# Altium project iron_board.PrjPcb
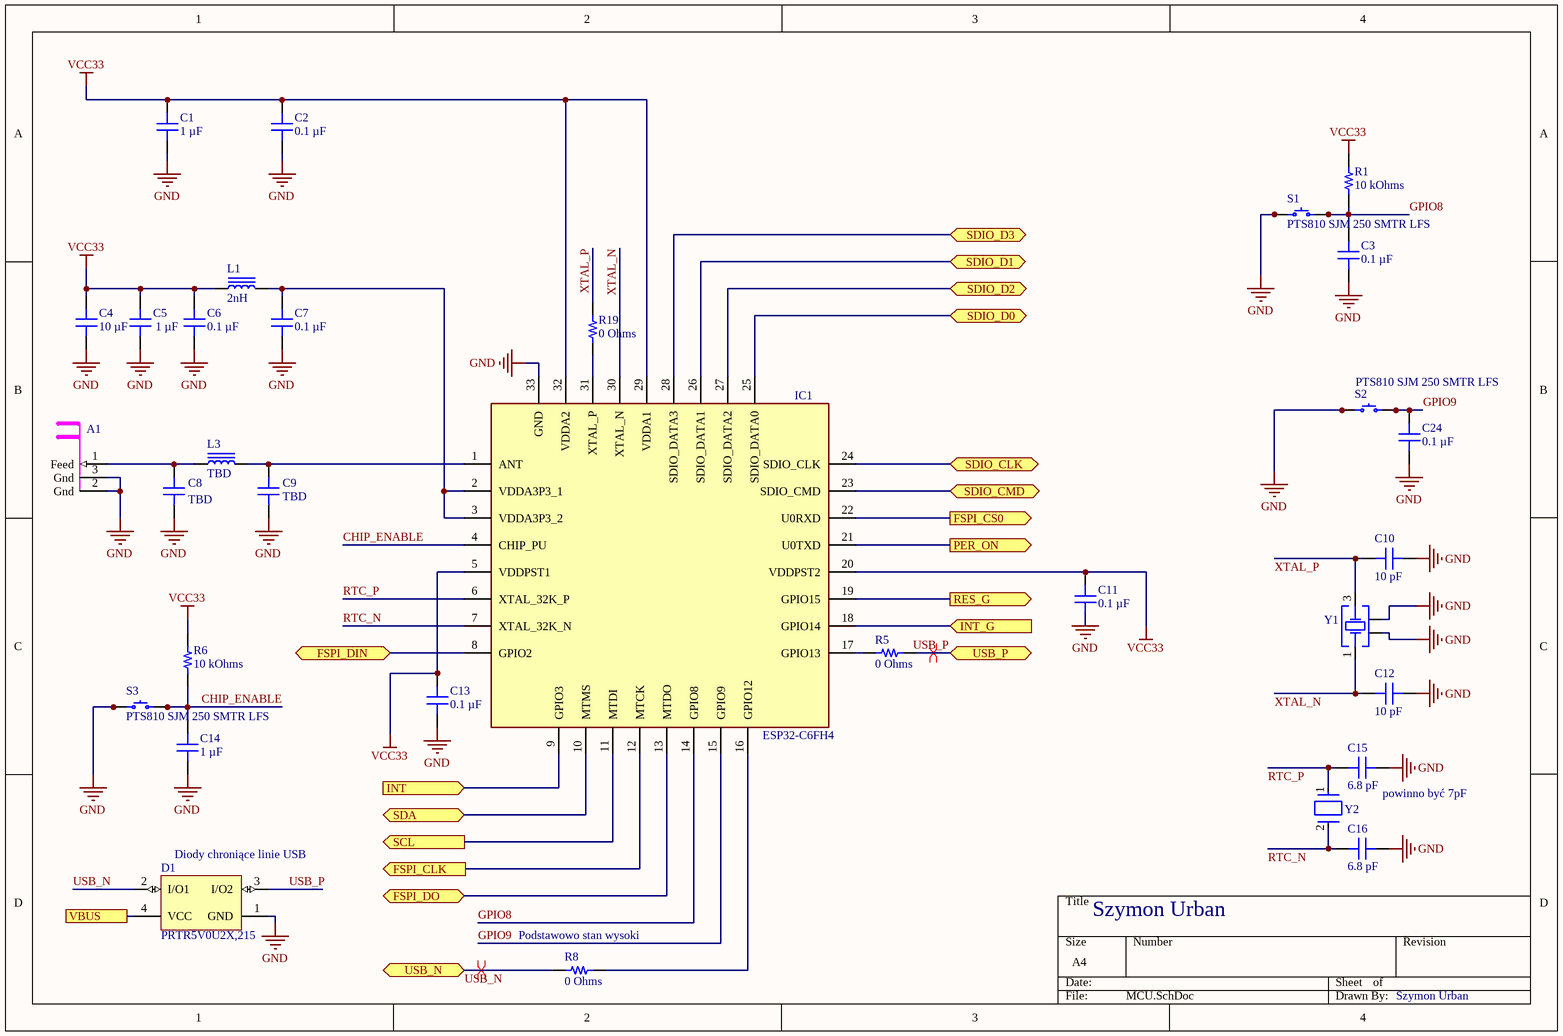
[diagram p0: MCU.SchDoc]
2 sheets, 73 parts. Net scope: flat (ports and power ports of the same name join across sheets).
Board file: iron_board_PCB.PcbDoc
Sheets:
  MCU.SchDoc
  peripherals.SchDoc

## Sheet MCU.SchDoc
size A4; SheetNumber: 1; SheetTotal: 2

### Parts
A1  Inverted F Antenna 2.4GHz  [IFA_2.4GHz]  (value not drawn)  (net tie, no BOM)
C1  1 µF  [CAP 0603_1608]
C2  0.1 µF  [CAP 0603_1608]
C3  0.1 µF  [CAP 0603_1608]
C4  10 µF  [CAP 0603_1608]
C5  1 µF  [CAP 0603_1608]
C6  0.1 µF  [CAP 0603_1608]
C7  0.1 µF  [CAP 0603_1608]
C8  TBD  [CAP 0402_1005]
C9  TBD  [CAP 0402_1005]
C10  10 pF  [CAP 0603_1608]
C11  0.1 µF  [CAP 0603_1608]
C12  10 pF  [CAP 0603_1608]
C13  0.1 µF  [CAP 0603_1608]
C14  1 µF  [CAP 0603_1608]
C15  6.8 pF  [CAP 0603_1608]
C16  6.8 pF  [CAP 0603_1608]
C24  0.1 µF  [CAP 0603_1608]
D1  PRTR5V0U2X,215  [NXP-SOT143B-4_V]
IC1  ESP32-C6FH4  [QFN50P500X500X90-33N]
L1  2nH  [IND 0603_1608 RF WW]
L3  TBD  [IND 0402_1005 RF WW]
R1  10 kOhms  [RES 0603_1608]
R5  0 Ohms  [RES 0603_1608]
R6  10 kOhms  [RES 0603_1608]
R8  0 Ohms  [RES 0603_1608]
R19  0 Ohms  [RES 0603_1608]
S1  PTS810 SJM 250 SMTR LFS  [C&K PTS810]
S2  PTS810 SJM 250 SMTR LFS  [C&K PTS810]
S3  PTS810 SJM 250 SMTR LFS  [C&K PTS810]
Y1  830108208709  [WE-XTAL_CFPX-218]  (value not drawn)
Y2  ABS07-32.768KHZ-7-1-T  [FP-ABS07-MFG]  (value not drawn)

### Ports
FSPI_CLK (out, see peripherals[2D]), FSPI_CS0 (out, see peripherals[2D]), FSPI_DIN (bidir, see peripherals[2D]), FSPI_DO (bidir, see peripherals[2D]), INT (in, see peripherals[4C]), INT_G (in, see peripherals[2C]), PER_ON (out, see peripherals[1D]), RES_G (out, see peripherals[2C]), SCL (out, see peripherals[2C], peripherals[3D]), SDA (bidir, see peripherals[2C], peripherals[3D]), SDIO_CLK (bidir, see peripherals[4B]), SDIO_CMD (bidir, see peripherals[4B]), SDIO_D0 (bidir, see peripherals[4A]), SDIO_D1 (bidir, see peripherals[4A]), SDIO_D2 (bidir, see peripherals[4A]), SDIO_D3 (bidir, see peripherals[4B]), USB_N (bidir, see peripherals[3A], peripherals[3B]), USB_P (bidir, see peripherals[3A], peripherals[3B]), VBUS (see peripherals[1A], peripherals[3A])

### Nets
GND: A1.2(Gnd) A1.3(Gnd) C1.1 C2.1 C3.1 C4.2 C5.1 C6.1 C7.1 C8.1 C9.1 C10.2 C11.1 C12.2 C13.1 C14.1 C15.2 C16.2 C24.1 D1.1(GND) IC1.33(GND) S1.1 S1.2 S2.1 S2.2 S3.1 S3.2 Y1.2(GND) Y1.4(GND)
VCC33: C1.2 C2.2 C4.1 C5.2 C6.2 C11.2 C13.2 IC1.5(VDDPST1) IC1.20(VDDPST2) IC1.29(VDDA1) IC1.32(VDDA2) L1.1 R1.2 R6.2
CHIP_ENABLE: C14.2 IC1.4(CHIP_PU) R6.1 S3.3 S3.4
GPIO8: C3.2 IC1.14(GPIO8) R1.1 S1.3 S1.4
GPIO9: C24.2 IC1.15(GPIO9) S2.3 S2.4
INT: IC1.9(GPIO3) ; port INT
RTC_N: C16.1 IC1.7(XTAL_32K_N) Y2.2
RTC_P: C15.1 IC1.6(XTAL_32K_P) Y2.1
SCL: IC1.11(MTDI) ; port SCL
SDA: IC1.10(MTMS) ; port SDA
USB_N: D1.2(I/O1) R8.2 ; port USB_N
USB_P: D1.3(I/O2) R5.1 ; port USB_P
XTAL_N: C12.1 IC1.30(XTAL_N) Y1.1(Crystal)
XTAL_P: C10.1 R19.1 Y1.3(Crystal)
VBUS: D1.4(VCC) ; port VBUS
NetA1_1: A1.1(Feed) C8.2 L3.1
NetC7_2: C7.2 IC1.2(VDDA3P3_1) IC1.3(VDDA3P3_2) L1.2
NetC9_2: C9.2 IC1.1(ANT) L3.2
NetIC1_8: IC1.8(GPIO2) ; port FSPI_DIN
NetIC1_12: IC1.12(MTCK) ; port FSPI_CLK
NetIC1_13: IC1.13(MTDO) ; port FSPI_DO
NetIC1_16: IC1.16(GPIO12) R8.1
NetIC1_17: IC1.17(GPIO13) R5.2
NetIC1_18: IC1.18(GPIO14) ; port INT_G
NetIC1_19: IC1.19(GPIO15) ; port RES_G
NetIC1_21: IC1.21(U0TXD) ; port PER_ON
NetIC1_22: IC1.22(U0RXD) ; port FSPI_CS0
NetIC1_23: IC1.23(SDIO_CMD) ; port SDIO_CMD
NetIC1_24: IC1.24(SDIO_CLK) ; port SDIO_CLK
NetIC1_25: IC1.25(SDIO_DATA0) ; port SDIO_D0
NetIC1_26: IC1.26(SDIO_DATA1) ; port SDIO_D1
NetIC1_27: IC1.27(SDIO_DATA2) ; port SDIO_D2
NetIC1_28: IC1.28(SDIO_DATA3) ; port SDIO_D3
NetIC1_31: IC1.31(XTAL_P) R19.2

### Layout directives
differential pair; net class USB_P: USB_N
differential pair: USB_P

### Notes on the sheet
- (near C15) powinno być 7pF
- (near D1) Diody chroniące linie USB
- Szymon Urban
- (near R8) Podstawowo stan wysoki

### Library data of the parts
A1 = IFA_2.4GHz
C1 C5 C14 = CC0603KRX7R6BB105: CAP CER 1UF 10V X7R 0603; manufacturer: Yageo; Tolerance: ±10%; Part Number: CC0603KRX7R6BB105; Value: 1 µF; Applications: General Purpose; Capacitance: 1 µF; componentlink1description: Datasheet; componentlink1url: https://www.yageo.com/upload/media/product/productsearch/datasheet/mlcc/UPY-GPHC_X7R_6.3V-to-50V_18.pdf; componentlink2description: DigiKey Link; componentlink2url: https://www.digikey.com/en/products/detail/yageo/CC0603KRX7R6BB105/5195204; Device Package: 0603 (1608 Metric); lastupdated: 15.01.2024 20:10:05; Lifecycle Status: Active; Minimum Order: 1; Mounting Type: Surface Mount, MLCC; Operating Temperature: -55°C ~ 125°C; Package / Case: 0603 (1608 Metric); packaging: TapeAndReel; partid: 2290; Part Status: Active; price: 0.01; series: CC; Size / Dimension: 0.063" L x 0.031" W (1.60mm x 0.80mm); Supplier 1: DigiKey; Supplier Part Number 1: 311-1796-1-ND; Temperature Coefficient: X7R; Thickness (Max): 0.035" (0.90mm); Voltage - Rated: 10V
C2 C3 C6 C7 C11 C13 C24 = CS0603KRX7R7BB104: CAP CER 0.1UF 16V X7R 0603; manufacturer: Yageo; Tolerance: ±10%; Part Number: CS0603KRX7R7BB104; Value: 0.1 µF; Applications: Boardflex Sensitive; Capacitance: 0.1 µF; componentlink1description: Datasheet; componentlink1url: http://www.yageo.com/NewPortal/yageodocoutput?fileName=/pdf/MLCC/UPY-ST_NPOX7R_16V-to-3KV_5.pdf; componentlink2description: DigiKey Link; componentlink2url: https://www.digikey.com/en/products/detail/yageo/CS0603KRX7R7BB104/6097897; Device Package: 0603 (1608 Metric); Features: Soft Termination; lastupdated: 15.01.2024 20:10:05; Lifecycle Status: Active; Minimum Order: 1; Mounting Type: Surface Mount, MLCC; Operating Temperature: -55°C ~ 125°C; Package / Case: 0603 (1608 Metric); packaging: TapeAndReel; partid: 2286; Part Status: Active; price: 0.01; series: CS; Size / Dimension: 0.063" L x 0.031" W (1.60mm x 0.80mm); Supplier 1: DigiKey; Supplier Part Number 1: 311-3560-1-ND; Temperature Coefficient: X7R; Thickness (Max): 0.037" (0.95mm); Voltage - Rated: 16V
C4 = GRM188D71A106KA73D: CAP CER 10UF 10V X7T 0603; manufacturer: Murata Electronics; Tolerance: ±10%; Part Number: GRM188D71A106KA73D; Value: 10 µF; Applications: General Purpose; Capacitance: 10 µF; componentlink1description: Datasheet; componentlink1url: https://search.murata.co.jp/Ceramy/image/img/A01X/G101/ENG/GRM188D71A106KA73-01.pdf; componentlink2description: DigiKey Link; componentlink2url: https://www.digikey.com/en/products/detail/murata-electronics/GRM188D71A106KA73D/6606090; Device Package: 0603 (1608 Metric); lastupdated: 15.01.2024 20:10:04; Lifecycle Status: Active; Minimum Order: 1; Mounting Type: Surface Mount, MLCC; Operating Temperature: -55°C ~ 125°C; Package / Case: 0603 (1608 Metric); packaging: TapeAndReel; partid: 2489; Part Status: Active; price: 0.03; series: GRM; Size / Dimension: 0.063" L x 0.031" W (1.60mm x 0.80mm); Supplier 1: DigiKey; Supplier Part Number 1: 490-14461-1-ND; Temperature Coefficient: X7T; Thickness (Max): 0.039" (1.00mm); Voltage - Rated: 10V
C8 C9 = 04023A6R8CAT2A: CAP CER 6.8PF 25V C0G/NP0 0402; manufacturer: AVX Corporation; Temperature Coefficient: C0G, NP0; Tolerance: ±0.25pF; Part Number: 04023A6R8CAT2A; Value: TBD; Applications: General Purpose; componentlink1description: Datasheet; componentlink1url: http://datasheets.avx.com/C0GNP0-Dielectric.pdf; componentlink2description: DigiKey Link; componentlink2url: http://digikey.com/product-detail/en/avx-corporation/04023A6R8CAT2A/478-12617-1-ND/9949155; Device Package: 0402 (1005 Metric); lastupdated: 08.02.2022 12:26:50; Lifecycle Status: Active; Minimum Order: 1; Mounting Type: Surface Mount, MLCC; Operating Temperature: -55°C ~ 125°C; Package / Case: 0402 (1005 Metric); packaging: TapeAndReel; partid: 6987; Part Status: Active; price: 0.06; series: -; Size / Dimension: 0.039" L x 0.020" W (1.00mm x 0.50mm); Supplier 1: DigiKey; Supplier Part Number 1: 478-12617-1-ND; Thickness (Max): 0.022" (0.56mm); Voltage - Rated: 25V
  C8: Capacitance: TBD
  C9: Capacitance: 6.8pF
C10 C12 = VJ0603A100FXACW1BC: CAP CER 10PF 50V C0G/NP0 0603; manufacturer: Vishay Vitramon; Temperature Coefficient: C0G, NP0; Tolerance: ±1%; Part Number: VJ0603A100FXACW1BC; Value: 10 pF; Applications: General Purpose; Capacitance: 10 pF; componentlink1description: Datasheet; componentlink1url: https://www.vishay.com/docs/28548/vjw1bcbascomseries.pdf; componentlink2description: DigiKey Link; componentlink2url: https://www.digikey.com/en/products/detail/vishay-vitramon/VJ0603A100FXACW1BC/8302770; Device Package: 0603 (1608 Metric); lastupdated: 15.01.2024 20:09:38; Lifecycle Status: Active; Minimum Order: 1; Mounting Type: Surface Mount, MLCC; Operating Temperature: -55°C ~ 125°C; Package / Case: 0603 (1608 Metric); packaging: TapeAndReel; partid: 42121; Part Status: Active; price: 0.01; series: VJ W1BC; Size / Dimension: 0.063" L x 0.031" W (1.60mm x 0.80mm); Supplier 1: DigiKey; Supplier Part Number 1: 720-VJ0603A100FXACW1BCCT-ND; Thickness (Max): 0.034" (0.87mm); Voltage - Rated: 50V
C15 C16 = GQM1875C2E6R8WB12D: CAP CER 6.8PF 250V C0G/NP0 0603; manufacturer: Murata Electronics; Temperature Coefficient: C0G, NP0; Tolerance: ±0.05pF; Part Number: GQM1875C2E6R8WB12D; Value: 6.8 pF; Applications: RF, Microwave, High Frequency; Capacitance: 6.8 pF; componentlink1description: Datasheet; componentlink1url: https://search.murata.co.jp/Ceramy/image/img/A01X/G101/ENG/GQM1875C2E6R8WB12-01.pdf; componentlink2description: DigiKey Link; componentlink2url: https://www.digikey.com/en/products/detail/murata-electronics/GQM1875C2E6R8WB12D/16033646; Device Package: 0603 (1608 Metric); Features: High Q, Low Loss; lastupdated: 15.01.2024 20:09:09; Lifecycle Status: Active; Minimum Order: 1; Mounting Type: Surface Mount, MLCC; Operating Temperature: -55°C ~ 125°C; Package / Case: 0603 (1608 Metric); packaging: TapeAndReel; partid: 50061; Part Status: Active; price: 0.11; series: GQM; Size / Dimension: 0.063" L x 0.031" W (1.60mm x 0.80mm); Supplier 1: DigiKey; Supplier Part Number 1: 490-GQM1875C2E6R8WB12DCT-ND; Thickness (Max): 0.031" (0.80mm); Voltage - Rated: 250V
D1 = CMP-2000-05285-1: Ultra Low Capacitance Double Rail-to-Rail ESD Protection Diode, 5.5 V, 1 pF, -40 to 85 degC, 4-Pin SOT143B, RoHS, Tape and Reel; Manufacturer: NXP Semiconductors; Capacitance Value: 16pF; Number of Elements: 1; Rad Hardened: No; Reverse Breakdown Voltage: 6V; Working Voltage (Max): 5.5V; Polarity: Uni-Directional; Configuration: Quad; Leakage Current: 0.1uA; Product Height (mm): 1mm; Suppressor Type: DiodeArrays; Product Length (mm): 3mm; Product Depth (mm): 1.4mm; ESD Protection Voltage: 8KV@ContactDisc; Package Type: SOT; Mounting: SurfaceMount; Packaging: TapeandReel; Datasheet Version: Rev. 02, 01/2008; Reverse Stand-off Voltage: 5.5V; Manufacturer URL: http://www.nxp.com/; Operating Temp Range: -40Cto85C; Operating Temperature Classification: Industrial; Working Voltage: 5.5V; Operating Temperature Min Deg. C: -40C; Datasheet URL: https://datasheet.ciiva.com/4479/prtr5v0u2x-102853-4479461.pdf; Leakage Current (Max): 0.1uA; Direction Type: Uni-Directional; Pin Count: 3+Tab; Operating Temperature Max Deg. C: 85C; Mounting Style: SurfaceMount; Package / Case: SOT
IC1 = ESP32-C6FH4: Integrated Circuit; Manufacturer_Name: Espressif Systems; Datasheet Link: https://www.mouser.ch/ProductDetail/Espressif-Systems/ESP32-C6FH4?qs=sGAEpiMZZMu3sxpa5v1qriveB5Rxa06Y9iJOmwW58jU%3D; Height: 0.9mm; Manufacturer_Part_Number: ESP32-C6FH4; Mouser Part Number: 356-ESP32-C6FH4; Mouser Price/Stock: https://www.mouser.co.uk/ProductDetail/Espressif-Systems/ESP32-C6FH4?qs=Imq1NPwxi77uZvg%252BuAIiXA%3D%3D
L1 = 744761020A: FIXED IND 2NH 700MA 80 MOHM SMD; Manufacturer: Würth Elektronik; DC Resistance (DCR): 80mOhm Max; Frequency - Self Resonant: 6.9GHz; Inductance Frequency - Test: 250MHz; Material - Core: Ceramic; Q @ Freq: 16 @ 250MHz; Shielding: Unshielded; Tolerance: ±0.2nH; Type: Wirewound; Part Number: 744761020A; ComponentLink1Description: Datasheet; ComponentLink1URL: https://katalog.we-online.com/pbs/datasheet/744761020A.pdf; ComponentLink2Description: DigiKey Link; ComponentLink2URL: http://digikey.com/product-detail/en/w-rth-elektronik/744761020A/732-744761020ACT-ND/10668665; Current Rating (Amps): 700mA; Device Package: 0603 (1608 Metric); Inductance: 2nH; LastUpdated: 06.09.2020 11:05:18; Lifecycle Status: Active; Minimum Order: 1; Mounting Type: Surface Mount; Operating Temperature: -40°C ~ 125°C; Package / Case: 0603 (1608 Metric); Packaging: Unknown; PartId: 1038; Part Status: Active; Price: 0.18; Series: WE-KI; Supplier 1: DigiKey; Supplier Part Number 1: 732-744761020ACT-ND; Supplier Device Package: 0603; Value: 2nH
L3 = LQW18ASR39J00D: FIXED IND 390NH 100MA 4.35OHM SM; Manufacturer: Murata Electronics; DC Resistance (DCR): 4.35Ohm Max; Frequency - Self Resonant: 900MHz; Inductance Frequency - Test: 100 MHz; Material - Core: Non-Magnetic; Q @ Freq: 25 @ 100MHz; Shielding: Unshielded; Tolerance: ±5%; Type: Wirewound; Part Number: LQW18ASR39J00D; ComponentLink2Description: DigiKey Link; ComponentLink2URL: https://www.digikey.com/en/products/detail/murata-electronics/LQW18ASR39J00D/10702651; Current Rating (Amps): 100 mA; Device Package: 0603 (1608 Metric); Height - Seated (Max): 0.039" (1.00mm); Inductance: 390 nH; LastUpdated: 15.01.2024 21:33:43; Lifecycle Status: Active; Minimum Order: 1; Mounting Type: Surface Mount; Operating Temperature: -40°C ~ 125°C; Package / Case: 0603 (1608 Metric); Packaging: TapeAndReel; PartId: 1604; Part Status: Active; Price: 0.05; Series: LQW15; Size / Dimension: 0.063" L x 0.031" W (1.60mm x 0.80mm); Supplier 1: DigiKey; Supplier Part Number 1: 490-LQW18ASR39J00DCT-ND; Supplier Device Package: 0603; Value: TBD
R1 R6 = RT0603FRE0710KL: RES SMD 10K OHM 1% 1/10W 0603; Manufacturer: Yageo; Power (Watts): 0.1W, 1/10W; Temperature Coefficient: ±50ppm/°C; Part Number: RT0603FRE0710KL; Value: 10 kOhms; ComponentLink1Description: Datasheet; ComponentLink1URL: https://www.yageo.com/upload/media/product/productsearch/datasheet/rchip/PYu-RT_1-to-0.01_RoHS_L_11.pdf; ComponentLink2Description: DigiKey Link; ComponentLink2URL: https://www.digikey.com/en/products/detail/yageo/RT0603FRE0710KL/1075040; Composition: Thin Film; Device Package: 0603 (1608 Metric); Height - Seated (Max): 0.022" (0.55mm); LastUpdated: 15.01.2024 20:40:25; Lifecycle Status: Active; Minimum Order: 1; Number of Terminations: 2; Operating Temperature: -55°C ~ 155°C; Package / Case: 0603 (1608 Metric); Packaging: TapeAndReel; PartId: 5671; Part Status: Active; Price: 0.01; Resistance: 10 kOhms; Series: RT; Size / Dimension: 0.063" L x 0.031" W (1.60mm x 0.80mm); Supplier 1: DigiKey; Supplier Part Number 1: YAG2321CT-ND; Supplier Device Package: 0603; Tolerance: ±1%
R5 R8 R19 = JR0603X26E: 0603 26 AMP JUMPER; Manufacturer: Ohmite; Power (Watts): 0.135W; Part Number: JR0603X26E; Value: 0 Ohms; ComponentLink1Description: Datasheet; ComponentLink1URL: https://www.ohmite.com/assets/docs/res_jr.pdf?r=false; ComponentLink2Description: DigiKey Link; ComponentLink2URL: https://www.digikey.com/en/products/detail/ohmite/JR0603X26E/10233371; Composition: Metal Element; Device Package: 0603 (1608 Metric); Height - Seated (Max): 0.022" (0.55mm); LastUpdated: 15.01.2024 20:40:20; Lifecycle Status: Active; Minimum Order: 1; Number of Terminations: 2; Operating Temperature: -55°C ~ 150°C; Package / Case: 0603 (1608 Metric); Packaging: TapeAndReel; PartId: 6812; Part Status: Active; Price: 0.10; Resistance: 0 Ohms; Series: JR; Size / Dimension: 0.063" L x 0.031" W (1.60mm x 0.80mm); Supplier 1: DigiKey; Supplier Part Number 1: JR0603X26ECT-ND; Supplier Device Package: 0603; Tolerance: Jumper
S1-S3 = PTS810 SJM 250 SMTR LFS: SWITCH TACTILE SPST-NO 0.05A 16V; Manufacturer: C&K; Actuator Height off PCB, Vertical: 2.50mm; Actuator Orientation: Top Actuated; Actuator Type: Oval Button; Contact Rating @ Voltage: 0.05A @ 16VDC; Illumination: Non-Illuminated; Operating Force: 160gf; Outline: 4.20mm x 3.20mm; Switch Function: Off-Mom; Part Number: PTS810 SJM 250 SMTR LFS; Circuit: SPST-NO; ComponentLink1Description: Datasheet; ComponentLink1URL: https://dznh3ojzb2azq.cloudfront.net/products/Tactile/PTS810/documents/datasheet.pdf; ComponentLink2Description: DigiKey Link; ComponentLink2URL: http://digikey.com/product-detail/en/c-k/PTS810-SJM-250-SMTR-LFS/CKN10502CT-ND/4176673; LastUpdated: 09.04.2020 10:00:13; Lifecycle Status: Active; Minimum Order: 1; Mounting Type: Surface Mount; Operating Temperature: -40°C ~ 85°C; Packaging: TapeAndReel; Part Status: Active; Price: 0.16; Series: PTS810; Supplier 1: DigiKey; Supplier Part Number 1: CKN10502CT-ND; Termination Style: J Lead
Y1 = CMP-03913-116855769-1: 830108208709 WE-XTAL Quartz Crystal; Frequency: 40MHz; Width: 2mm; Max Operating Temperature: 70°C; Height: 600µm; Min Operating Temperature: -20°C; NexarPartId: 116855769; Length: 2.5mm
Y2 = CMP-27762-015873-1: Crystal 32.768kHz ±10ppm (Tol) 7pF FUND 70kΩ 2-Pin CSMD T/R; ESR (Equivalent Series Resistance): 70kR; Min Operating Temperature: -40°C; Height: 0.035inch; Max Operating Temperature: 85°C; Length: 0.126inch; RoHS Compliant: Yes; Width: 0.061inch; Frequency Tolerance: 10ppm; Lead Free: Lead Free; Operating Frequency: 32.768 kHz; Packaging: Cut Tape; Series: ABS07; Case/Package: SMD/SMT; Frequency: 32.768kHz; Load Capacitance: 7pF; Mount: Surface Mount

## Sheet peripherals.SchDoc
size A4; SheetNumber: 2; SheetTotal: 2
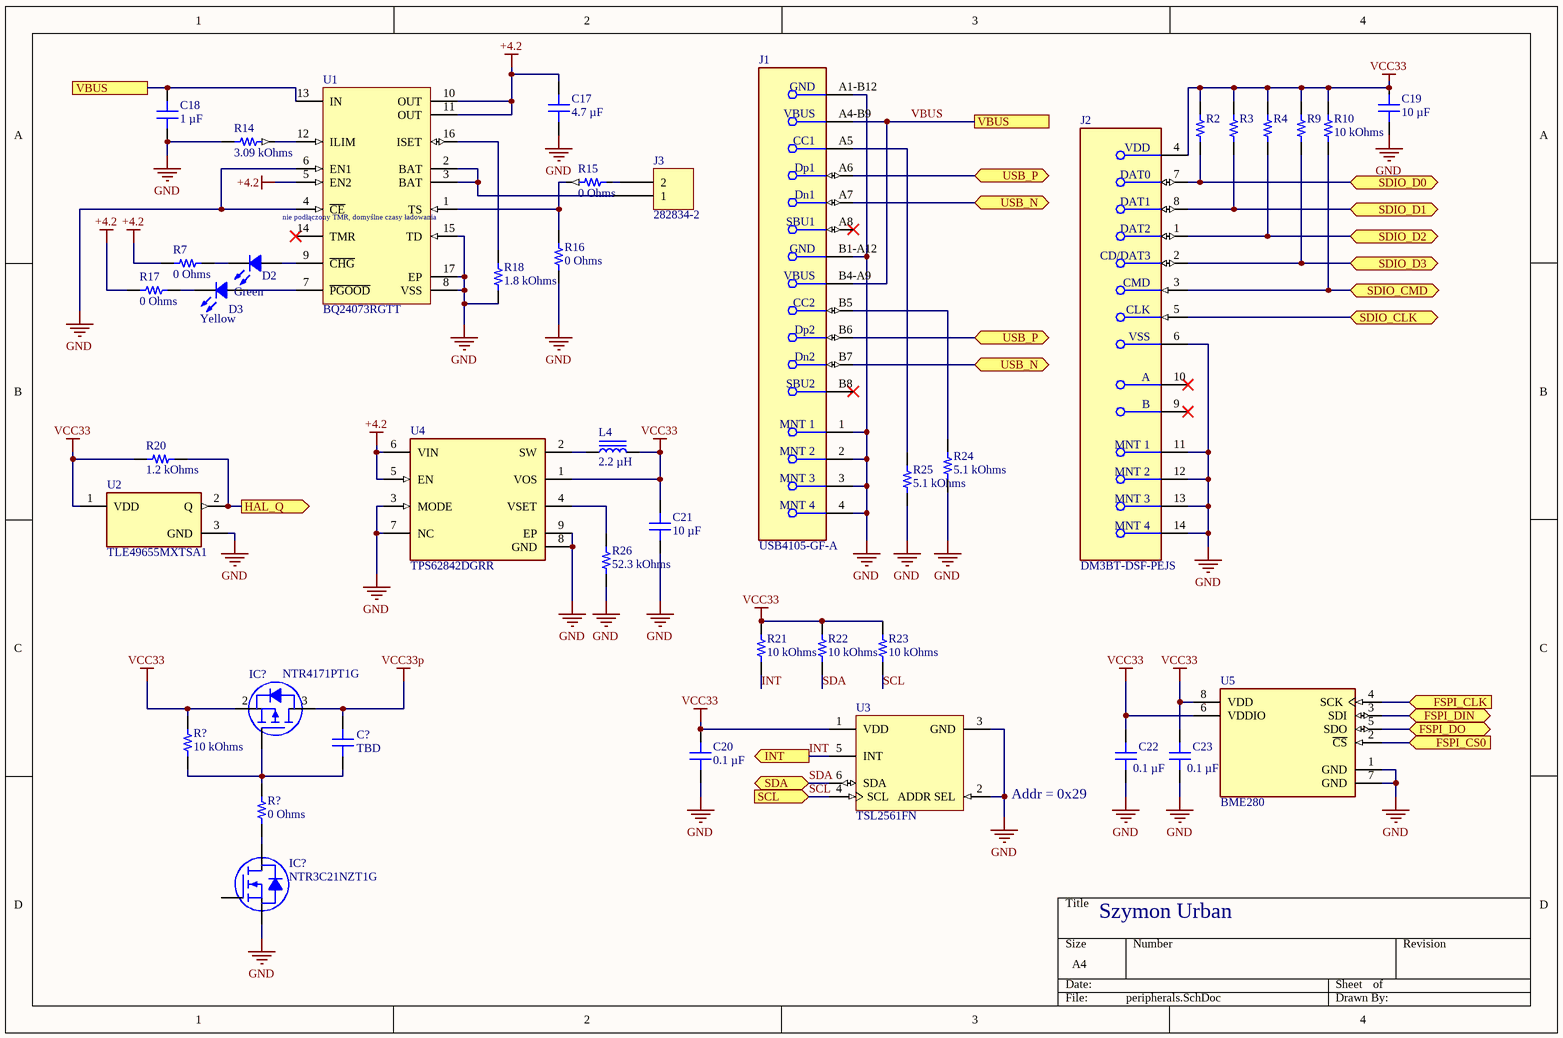
[diagram p1: peripherals.SchDoc]

### Parts
(Parts that share a designator on the sheet are numbered #1, #2 ... from top to bottom, then left to right.)
C17  4.7 µF  [CAP 0603_1608]
C18  1 µF  [CAP 0603_1608]
C19  10 µF  [CAP 0603_1608]
C20  0.1 µF  [CAP 0603_1608]
C21  10 µF  [CAP 0603_1608]
C22  0.1 µF  [CAP 0603_1608]
C23  0.1 µF  [CAP 0603_1608]
C?  TBD  [CAP 0402_1005]
D2  Green  [LED 0805_2012 GREEN]
D3  Yellow  [LED 0805_2012 YELLOW]
IC?#1  NTR4171PT1G  [ON SEMI SOT-23-3]
IC?#2  NTR3C21NZT1G  [ON SEMI SOT-23-3]
J1  USB4105-GF-A  [FP-USB4105-GF-A-MFG]
J2  DM3BT-DSF-PEJS  [FP-DM3BT-DSF-PEJS-MFG]
J3  282834-2  [TE 282834-2]
L4  2.2 µH  [IND 0402_1005 RF WW]
R2  10 kOhms  [RES 0603_1608]  (value not drawn)
R3  10 kOhms  [RES 0603_1608]  (value not drawn)
R4  10 kOhms  [RES 0603_1608]  (value not drawn)
R7  0 Ohms  [RES 0603_1608]
R9  10 kOhms  [RES 0603_1608]  (value not drawn)
R10  10 kOhms  [RES 0603_1608]
R14  3.09 kOhms  [RES 0603_1608]
R15  0 Ohms  [RES 0603_1608]
R16  0 Ohms  [RES 0603_1608]
R17  0 Ohms  [RES 0603_1608]
R18  1.8 kOhms  [RES 0603_1608]
R20  1.2 kOhms  [RES 0603_1608]
R21  10 kOhms  [RES 0603_1608]
R22  10 kOhms  [RES 0603_1608]
R23  10 kOhms  [RES 0603_1608]
R24  5.1 kOhms  [RES 0603_1608]
R25  5.1 kOhms  [RES 0603_1608]
R26  52.3 kOhms  [RES 0603_1608]
R?#1  10 kOhms  [RES 0603_1608]
R?#2  0 Ohms  [RES 0603_1608]
U1  BQ24073RGTT  [RGT0016C_V]
U2  TLE49655MXTSA1  [FP-PG-SOT23-3-MFG]
U3  TSL2561FN  [AMS-FN-6-2000X2000DE_V]
U4  TPS62842DGRR  [FP-DGR0008A-MFG]
U5  BME280  [FP-BME280-MFG]

### Ports
FSPI_CLK (in, see MCU[1D]), FSPI_CS0 (in, see MCU[3C]), FSPI_DIN (bidir, see MCU[1C]), FSPI_DO (bidir, see MCU[1D]), HAL_Q (out, see MCU[3C]), INT (out, see MCU[1D]), SCL (in, see MCU[1D]), SDA (bidir, see MCU[1D]), SDIO_CLK (bidir, see MCU[3B]), SDIO_CMD (bidir, see MCU[3B]), SDIO_D0 (bidir, see MCU[3B]), SDIO_D1 (bidir, see MCU[3B]), SDIO_D2 (bidir, see MCU[3B]), SDIO_D3 (bidir, see MCU[3A]), USB_N (bidir, see MCU[1D], peripherals[3A]), USB_N (bidir, see MCU[1D], peripherals[3B]), USB_P (bidir, see MCU[3C], peripherals[3A]), USB_P (bidir, see MCU[3C], peripherals[3B]), VBUS (see MCU[1D], peripherals[1A]), VBUS (see MCU[1D], peripherals[3A])

### Nets
+4.2: C17.2 R7.2 R17.2 U1.5(EN2) U1.10(OUT) U1.11(OUT) U4.5(EN) U4.6(VIN)
GND: C17.1 C18.1 C19.2 C20.1 C21.2 C22.1 C23.1 IC?#2.2(S) J1.1(MNT_1) J1.2(MNT_2) J1.3(MNT_3) J1.4(MNT_4) J1.A1-B12(GND) J1.B1-A12(GND) J2.6(VSS) J2.11(MNT_1) J2.12(MNT_2) J2.13(MNT_3) J2.14(MNT_4) R14.1 R16.1 R18.1 R24.1 R25.1 R26.1 U1.4(~{CE}) U1.6(EN1) U1.8(VSS) U1.15(TD) U1.17(EP) U2.3(GND) U3.2(ADDR_SEL) U3.3(GND) U4.3(MODE) U4.7(NC) U4.8(GND) U4.9(EP) U5.1(GND) U5.7(GND)
VCC33: C19.1 C20.2 C21.1 C22.2 C23.2 IC?#1.2(S) J2.4(VDD) L4.2 R2.2 R3.2 R4.2 R9.2 R10.2 R20.1 R21.2 R22.2 R23.2 R?#1.2 U2.1(VDD) U3.1(VDD) U4.1(VOS) U5.6(VDDIO) U5.8(VDD)
VCC33p: C?.2 IC?#1.3(D)
INT: R21.1 U3.5(INT) ; port INT
SCL: R23.1 U3.4(SCL) ; port SCL
SDA: R22.1 U3.6(SDA) ; port SDA
USB_N: J1.A7(Dn1) J1.B7(Dn2) ; port USB_N
USB_P: J1.A6(Dp1) J1.B6(Dp2) ; port USB_P
VBUS: C18.2 J1.A4-B9(VBUS) J1.B4-A9(VBUS) U1.13(IN) ; port VBUS
NetC?_1: C?.1 IC?#1.1(G) R?#1.1 R?#2.2
NetD2_1: D2.1 U1.9(~{CHG})
NetD2_2: D2.2 R7.1
NetD3_1: D3.1 U1.7(~{PGOOD})
NetD3_2: D3.2 R17.1
NetIC1_8: U5.3(SDI) ; port FSPI_DIN
NetIC1_12: U5.4(SCK) ; port FSPI_CLK
NetIC1_13: U5.5(SDO) ; port FSPI_DO
NetIC1_22: U5.2(~{CS}) ; port FSPI_CS0
NetIC1_23: J2.3(CMD) R10.1 ; port SDIO_CMD
NetIC1_24: J2.5(CLK) ; port SDIO_CLK
NetIC1_25: J2.7(DAT0) R2.1 ; port SDIO_D0
NetIC1_26: J2.8(DAT1) R3.1 ; port SDIO_D1
NetIC1_27: J2.1(DAT2) R4.1 ; port SDIO_D2
NetIC1_28: J2.2(CD/DAT3) R9.1 ; port SDIO_D3
NetIC?#2_3: IC?#2.3(D) R?#2.1
NetJ1_A5: J1.A5(CC1) R25.2
NetJ1_B5: J1.B5(CC2) R24.2
NetJ3_1: J3.1 U1.2(BAT) U1.3(BAT)
NetJ3_2: J3.2 R15.2
NetL4_1: L4.1 U4.2(SW)
NetR14_2: R14.2 U1.12(ILIM)
NetR15_1: R15.1 R16.2 U1.1(TS)
NetR18_2: R18.2 U1.16(ISET)
NetR20_2: R20.2 U2.2(Q) ; port HAL_Q
NetR26_2: R26.2 U4.4(VSET)

Not connected (* = marked no-connect by the designer): IC?#2 1(G); J1 A8(SBU1)* B8(SBU2)*; J2 9(B)* 10(A)*; U1 14(TMR)*

### Notes on the sheet
- (near U1) nie podłączony TMR, domyślne czasy ładowania
- Addr = 0x29
- Szymon Urban

### Library data of the parts
C17 = GRM188R61C475KE11D: CAP CER 4.7UF 16V X5R 0603; manufacturer: Murata Electronics; Tolerance: ±10%
C18 = CC0603KRX7R6BB105: as C1 on sheet MCU
C19 C21 = GRM188D71A106KA73D: as C4 on sheet MCU
C20 C22 C23 = CS0603KRX7R7BB104: as C2 on sheet MCU
C? = 04023A6R8CAT2A: as C8 on sheet MCU
D2 = 150080VS75000: LED GREEN CLEAR 0805 SMD; Manufacturer: Würth Elektronik; Configuration: Standard; Current - Test: 20mA; Lens Color: Colorless; Lens Size: 1.40mm x 1.25mm; Lens Style: Rectangle with Flat Top; Millicandela Rating: 40mcd; Viewing Angle: 140°; Voltage - Forward (Vf) (Typ): 2V; Wavelength - Dominant: 570nm; Wavelength - Peak: 572nm
D3 = 150080YS75000: LED YELLOW CLEAR 0805 SMD; Manufacturer: Würth Elektronik; Configuration: Standard; Current - Test: 20mA; Lens Color: Colorless; Lens Size: 1.40mm x 1.25mm; Lens Style: Rectangle with Flat Top; Millicandela Rating: 120mcd; Viewing Angle: 140°; Voltage - Forward (Vf) (Typ): 2V; Wavelength - Dominant: 590nm; Wavelength - Peak: 595nm
IC?#1 = NTR4171PT1G: MOSFET P-CH 30V 2.2A SOT23; Manufacturer: ON Semiconductor; Current - Continuous Drain (Id) @ 25°C: 2.2A (Ta); Drive Voltage (Max Rds On,  Min Rds On): 2.5V, 10V; FET Type: P-Channel; Gate Charge (Qg) (Max) @ Vgs: 15.6nC @ 10V; Input Capacitance (Ciss) (Max) @ Vds: 720pF @ 15V; Power Dissipation (Max): 480mW (Ta); Rds On (Max) @ Id, Vgs: 75mOhm @ 2.2A, 10V; Vgs (Max): ±12V; Vgs(th) (Max) @ Id: 1.4V @ 250µA
IC?#2 = NTR3C21NZT1G: MOSFET N-CH 20V 3.6A SOT23-3; Manufacturer: ON Semiconductor; Current - Continuous Drain (Id) @ 25°C: 3.6A (Ta); Drive Voltage (Max Rds On,  Min Rds On): 1.8V, 4.5V; FET Type: N-Channel; Gate Charge (Qg) (Max) @ Vgs: 17.8nC @ 4.5V; Input Capacitance (Ciss) (Max) @ Vds: 1540pF @ 16V; Power Dissipation (Max): 470mW (Ta); Rds On (Max) @ Id, Vgs: 24mOhm @ 5A, 4.5V; Vgs (Max): ±8V; Vgs(th) (Max) @ Id: 1V @ 250µA
J1 = CMP-245163-000001-1: CONN RCPT USB2.0 TYPEC 5A; Manufacturer: GCT; Voltage Rating: 20V; Is Female: yes; Current Rating: 5/6.25/1.25/0.25A; Number Of Contacts: 16; Conn Orientation: Right Angle
J2 = CMP-11597-000004-1: CONN MICRO SD CARD PUSH-PUSH R/A; Connector Type: Connector; Pitch: 1.1mm; Insulation Resistance: 1GR; Contact Resistance: 100mR; Number of Positions: 8; Max Voltage Rating (AC): 125V; Gender: Female; Current Rating: 500mA
J3 = 282834-2: TERM BLK 2P SIDE ENT 2.54MM PCB; Manufacturer: TE Connectivity AMP Connectors; Current: 10A; Mating Orientation: Horizontal with Board; Number of Levels: 1; Pitch: 0.100" (2.54mm); Positions Per Level: 2; Voltage: 150V; Wire Gauge: 16-30 AWG; Wire Termination: Screw - Rising Cage Clamp
L4 = LQW15CE2R2M10D: FIXED IND 2.2UH 85MA 1.8OHM SMD; Manufacturer: Murata Electronics; DC Resistance (DCR): 1.8Ohm Max; Frequency - Self Resonant: 100MHz; Inductance Frequency - Test: 1 MHz; Material - Core: Ferrite; Shielding: Unshielded; Tolerance: ±20%; Type: Drum Core, Wirewound
R2-R4 R9 R10 R21-R23 = RT0603FRE0710KL: as R1 on sheet MCU
R7 R15-R17 R?#2 = JR0603X26E: as R5 on sheet MCU
R14 = RMCF0603FT3K09: RES 3.09K OHM 1% 1/10W 0603; Manufacturer: Stackpole Electronics Inc; Power (Watts): 0.1W, 1/10W; Temperature Coefficient: ±100ppm/°C
R18 = RMCF0603JG1K80: RES 1.8K OHM 5% 1/10W 0603; Manufacturer: Stackpole Electronics Inc; Power (Watts): 0.1W, 1/10W; Temperature Coefficient: ±200ppm/°C
R20 = RC0603FR-131K2L: RES 1.2K OHM 1% 1/10W 0603; Manufacturer: Yageo; Power (Watts): 0.1W, 1/10W; Temperature Coefficient: ±100ppm/°C
R24 R25 = RR0816P-512-D: RES SMD 5.1K OHM 0.5% 1/16W 0603; Manufacturer: Susumu; Power (Watts): 0.063W, 1/16W; Temperature Coefficient: ±25ppm/°C
R26 = RC0603FR-1052K3L: RES 52.3K OHM 1% 1/10W 0603; Manufacturer: Yageo; Power (Watts): 0.1W, 1/10W; Temperature Coefficient: ±100ppm/°C
R?#1 = TNPW060310K0FHTA: RES 10K OHM 1% 1/10W 0603; Manufacturer: Vishay Dale; Power (Watts): 0.1W, 1/10W; Temperature Coefficient: ±50ppm/°C
U1 = CMP-0321-00214-2: USB-Friendly Li-Ion Battery Charger and Power-Path Management IC, Vout 4.4 V, 4.3 V, -40 to 85 degC, 16-pin QFN (RGT), Green (RoHS & no Sb/Br); Manufacturer: Texas Instruments; Over Voltage Protection: N; SubFamily: Battery Charge Management; Vin(Min)(V): 4.3
U2 = CMP-00196-59660426-1: TLE49655MXTSA1 Hall Effect Sensor 5mA Unipolar 3.3V/5V Automotive 3-Pin SOT-23 T/R; Polarity: South Pole; Operating Supply Voltage: 5.5V; Max Supply Current: 1.4mA
U3 = CMP-0550-00041-2: Light-to-Digital Converter, 2.7 to 3.6 V, FN-6, Pb-Free, Reel; Manufacturer: AMS; Interface: I2C - 1.8; Maximum Lux: 40000; Programmable: Gain, Integration Time , Interrupt; Supply Voltage (V): 2.7 - 3.6
U4 = CMP-04918-000211-1: STEP DOWN CONVERTER
U5 = CMP-2000-05073-3: SENSOR PRESSURE HUMIDITY TEMP; Sensor Type: Temperature; Accuracy: 3%; Response Time: 1s; Output Type: SPI

## Nets that join several sheets
GND: MCU (29 pins), peripherals (39 pins)
VCC33: MCU (14 pins), peripherals (23 pins)
INT: MCU (IC1.9), peripherals (R21.1 U3.5)
NetIC1_8: MCU (IC1.8), peripherals (U5.3)
NetIC1_12: MCU (IC1.12), peripherals (U5.4)
NetIC1_13: MCU (IC1.13), peripherals (U5.5)
NetIC1_22: MCU (IC1.22), peripherals (U5.2)
NetIC1_23: MCU (IC1.23), peripherals (J2.3 R10.1)
NetIC1_24: MCU (IC1.24), peripherals (J2.5)
NetIC1_25: MCU (IC1.25), peripherals (J2.7 R2.1)
NetIC1_26: MCU (IC1.26), peripherals (J2.8 R3.1)
NetIC1_27: MCU (IC1.27), peripherals (J2.1 R4.1)
NetIC1_28: MCU (IC1.28), peripherals (J2.2 R9.1)
SCL: MCU (IC1.11), peripherals (R23.1 U3.4)
SDA: MCU (IC1.10), peripherals (R22.1 U3.6)
USB_N: MCU (D1.2 R8.2), peripherals (J1.A7 J1.B7)
USB_P: MCU (D1.3 R5.1), peripherals (J1.A6 J1.B6)
VBUS: MCU (D1.4), peripherals (C18.2 J1.A4-B9 J1.B4-A9 U1.13)

## Assembly variants
TBD: not fitted D? L2 R7